# Altium schematic sheet SM_Balam_22.SchDoc
size Tabloid; SheetNumber: 1; SheetTotal: 2
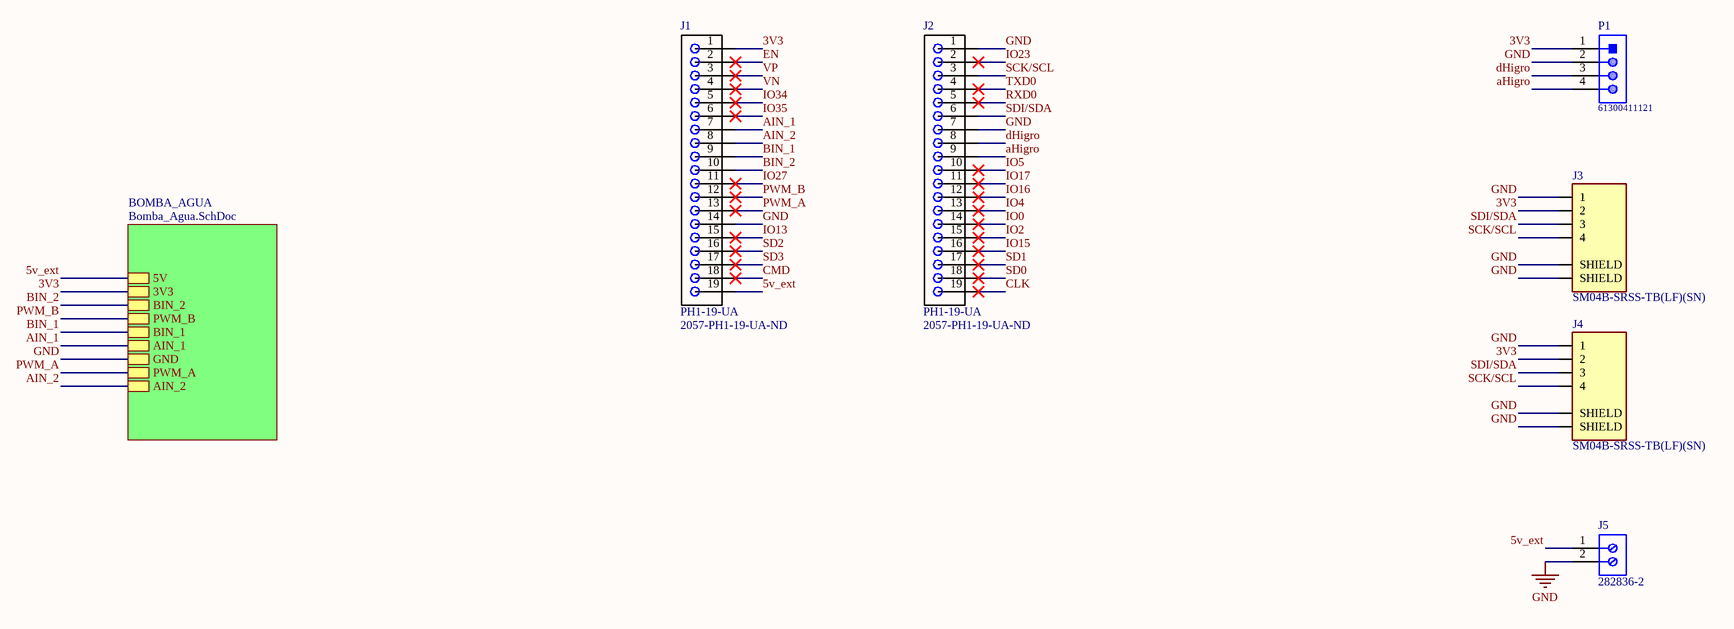
[diagram p0: SM_Balam_22.SchDoc]

## Parts
J1  PH1-19-UA  Supplier Part Number 1: 2057-PH1-19-UA-ND  [PH1-19-UA - Socket]
J2  PH1-19-UA  Supplier Part Number 1: 2057-PH1-19-UA-ND  [PH1-19-UA - Socket]
J3  SM04B-SRSS-TB(LF)(SN)  [JST_SM04B-SRSS-TB(LF)(SN)]
J4  SM04B-SRSS-TB(LF)(SN)  [JST_SM04B-SRSS-TB(LF)(SN)]
J5  282836-2  [TECO-282836-2_V]
P1  61300411121  [61300411121]

## Sub-sheets
BOMBA_AGUA = Bomba_Agua.SchDoc: 5V, 3V3, BIN_2, PWM_B, BIN_1, AIN_1, GND, PWM_A, AIN_2

## Nets
GND: J1.14 J2.1 J2.7 J3.1 J3.S1(SHIELD) J3.S2(SHIELD) J4.1 J4.S1(SHIELD) J4.S2(SHIELD) J5.2 P1.2 ; sheet BOMBA_AGUA/GND
3V3: J1.1 J3.2 J4.2 P1.1 ; sheet BOMBA_AGUA/3V3
5v_ext: J1.19 J5.1 ; sheet BOMBA_AGUA/5V
aHigro: J2.9 P1.4
AIN_1: J1.7 ; sheet BOMBA_AGUA/AIN_1
AIN_2: J1.8 ; sheet BOMBA_AGUA/AIN_2
BIN_1: J1.9 ; sheet BOMBA_AGUA/BIN_1
BIN_2: J1.10 ; sheet BOMBA_AGUA/BIN_2
CLK: J2.19
CMD: J1.18
dHigro: J2.8 P1.3
EN: J1.2
IO0: J2.14
IO2: J2.15
IO4: J2.13
IO5: J2.10
IO13: J1.15
IO15: J2.16
IO16: J2.12
IO17: J2.11
IO23: J2.2
IO27: J1.11
IO34: J1.5
IO35: J1.6
PWM_A: J1.13 ; sheet BOMBA_AGUA/PWM_A
PWM_B: J1.12 ; sheet BOMBA_AGUA/PWM_B
RXD0: J2.5
SCK/SCL: J2.3 J3.4 J4.4
SD0: J2.18
SD1: J2.17
SD2: J1.16
SD3: J1.17
SDI/SDA: J2.6 J3.3 J4.3
TXD0: J2.4
VN: J1.4
VP: J1.3

## Library data of the parts
J1 J2 = PH1-19-UA: Connector Header Through Hole 19 position 0.100" (2.54mm); Supplier 1: Digi-Key
J3 J4 = SM04B-SRSS-TB(LF)(SN): Connector Header Surface Mount, Right Angle 4 position 0.039 _1.00mm_; MF: JST Sales; MP: SM04B-SRSS-TB_LF__SN_; Price: None; SnapEDA_Link: https://www.snapeda.com/parts/SM04B-SRSS-TB%28LF%29%28SN%29/JST%20Sales%20America%20Inc./view-part/557466/?ref=snap; Value: *; Availability: Unavailable; Package: None
J5 = CMP-1684-00017-1: Female Header, Pitch 5 mm, 1 x 2 Position, Height 10 mm, Tail Length 3.5 mm, Rohs, Bulk; Manufacturer: TE Connectivity; Wire Gauge: 16-30AWG; Product Training Modules: Wire-to-BoardEurostyleTerminalBlocks; Clamp Material - Plating: Brass-NickelPlated; Voltage: 300V; Mating Orientation: HorizontalwithBoard; Current: 13.5A; Pitch: 0.197"(5.00mm); Screw Thread: M3; 3D Model: 282836-2.pdf; Other Names: 5ULV-02B / A98076; Dynamic Catalog: BuchananSeries; Number of Levels: 1; Torque - Screw: 0.68Nm(6Lb-In); Featured Product: EurostyleTerminalBlockConnectors; Positions Per Level: 2; Wire Termination: Screw-RisingCageClamp; Datasheet URL: http://www.te.com.cn/commerce/DocumentDelivery/DDEController?Action=showdoc&DocId=Catalog+Section%7F1308389_EUROSTYLE_TERMINAL_BLOCKS%7F0607%7Fpdf%7FEnglish%7FENG_CS_1308389_EUROSTYLE_TERMINAL_BLOCKS_0607.pdf%7F282836-2; Color: Green; Family: TerminalBlocks-WiretoBoard; RoHS Information: 282836-2StatementofCompliance; Standard Package: 300; Contact Material - Plating: Brass-TinPlated; Manufacturer URL: http://www.te.com; Housing Material: Polyamide(PA66),Nylon6/6; Features: Interlocking(Side); Package Description: Female Header, Pitch 5 mm, 1 x 2 Position, Height 10 mm, Tail Length 3.5 mm; Mounting Type: ThroughHole; Package Reference: THD; Packaging: Bulk; Series: Buchanan; Category: Connectors,Interconnects; Screw Material - Plating: Brass-NickelPlated
P1 = CMP-1502-01064-1: THT Vertical Pin Header WR-PHD, Pitch 2.54 mm, Single Row, 4 pins; Manufacturer: Wurth Elektronik; Withstanding Voltage: 500VAC; Rated Current: 3A; Working Voltage: 250VAC; Pin Number: 4; Gender: Male; Contact Resistance: 20mOhm; Pitch: 2.54mm; Manufacturer URL: http://www.we-online.de; Operating Temperature: -40to105degC; Packaging: Bag; Mounting Technology: THT; Package Reference: 61300411121; Datasheet URL: https://katalog.we-online.de/em/datasheet/6130xx11121.pdf; Publisher: WurthElektronik; Part Number: 61300411121; Row Number: Single; Orientation: Vertical